# Altium schematic sheet Misc.SchDoc
size A4; SheetNumber: 5; SheetTotal: 6
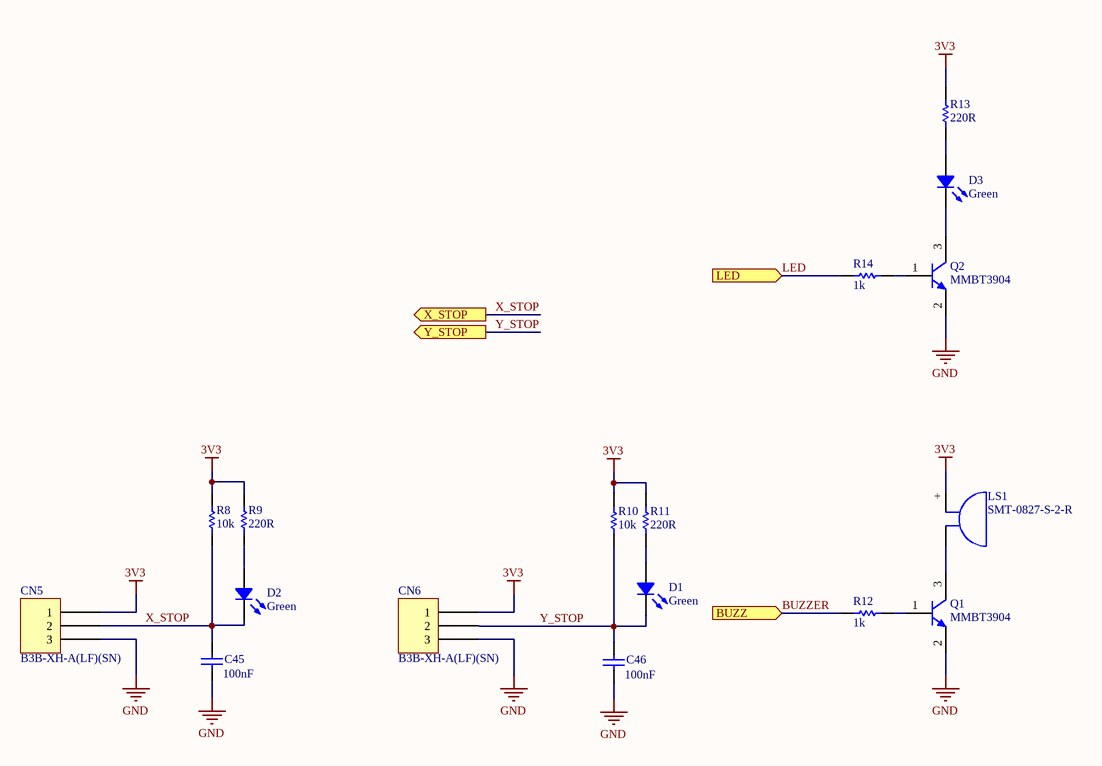
[diagram p0: Misc.SchDoc]

## Parts
C45  value 100nF  [1608[0603]]  (hidden comment: X5R)
C46  value 100nF  [1608[0603]]  (hidden comment: X5R)
CN5  B3B-XH-A(LF)(SN)  [JST XH B3B-XH-A]
CN6  B3B-XH-A(LF)(SN)  [JST XH B3B-XH-A]
D1  Green  [LED 0805_2012 GREEN]
D2  Green  [LED 0805_2012 GREEN]
D3  Green  [LED 0805_2012 GREEN]
LS1  SMT-0827-S-2-R  [PUI Audio SMT-0827-S-2-R]
Q1  MMBT3904  [SOT-23_N]
Q2  MMBT3904  [SOT-23_N]
R8  value 10k  [1608[0603]]  (hidden comment: Res1)
R9  value 220R  [1608[0603]]  (hidden comment: Res1)
R10  value 10k  [1608[0603]]  (hidden comment: Res1)
R11  value 220R  [1608[0603]]  (hidden comment: Res1)
R12  value 1k  [1608[0603]]  (hidden comment: Res1)
R13  value 220R  [1608[0603]]  (hidden comment: Res1)
R14  value 1k  [1608[0603]]  (hidden comment: Res1)

## Ports
BUZZ (in, see Motherboard[1B], STM32F7[2A]), LED (in, see Motherboard[1B], STM32F7[2A]), X_STOP (out, see Motherboard[1B], STM32F7[2A]), Y_STOP (out, see Motherboard[1B], STM32F7[2A])

## Nets
3V3: CN5.1 CN6.1 LS1.+ R8.1 R9.1 R10.1 R11.1 R13.1
GND: C45.2 C46.2 CN5.3 CN6.3 Q1.2(E) Q2.2(E)
BUZZER: R12.1 ; port BUZZ
LED: R14.1 ; port LED
X_STOP: C45.1 CN5.2 D2.2 R8.2 ; port X_STOP
Y_STOP: C46.1 CN6.2 D1.2 R10.2 ; port Y_STOP
NetD1_1: D1.1 R11.2
NetD2_1: D2.1 R9.2
NetD3_1: D3.1 R13.2
NetD3_2: D3.2 Q2.3(C)
NetLS1_-: LS1.- Q1.3(C)
NetQ1_1: Q1.1(B) R12.2
NetQ2_1: Q2.1(B) R14.2

## Library data of the parts
C45 C46 = Cap: Capacitor; Published: 8-Jun-2000; LatestRevisionDate: 17-Jul-2002; LatestRevisionNote: Re-released for DXP Platform.; PackageReference: RAD-0.3; Publisher: Altium Limited; PackageDescription: Radial Cap, Thru-Hole; 2 Leads; 0.3 in Pin Spacing
CN5 CN6 = B3B-XH-A(LF)(SN): CONN HEADER VERT 3POS 2.5MM; Manufacturer: JST Sales America Inc.; Contact Length - Post: 0.134" (3.40mm); Current Rating (Amps): 3A; Material Flammability Rating: UL94 V-0; Number of Positions: 3; Number of Positions Loaded: All; Pitch - Mating: 0.098" (2.50mm); Shrouding: Shrouded - 4 Wall; Style: Board to Cable/Wire; Voltage Rating: 250V; Part Number: B3B-XH-A(LF)(SN); ComponentLink1Description: Datasheet; ComponentLink1URL: http://www.jst-mfg.com/product/pdf/eng/eXH.pdf; ComponentLink2Description: DigiKey Link; ComponentLink2URL: http://digikey.com/product-detail/en/jst-sales-america-inc/B3B-XH-A-LF-SN/455-2248-ND/1651046; Connector Type: Header; Contact Finish - Mating: Tin; Contact Finish - Post: Tin; Contact Material: Brass; Contact Shape: Square; Contact Type: Male Pin; Fastening Type: Detent Lock; Insulation Color: Natural; Insulation Height: 0.276" (7.00mm); Insulation Material: Polyamide (PA66), Nylon 6/6; LastUpdated: 1/12/2020 11:46:22 PM; Lifecycle Status: Active; Minimum Order: 1; Mounting Type: Through Hole; Number of Rows: 1; Operating Temperature: -25°C ~ 85°C; Packaging: Bulk; PartId: 68; Part Status: Active; Price: 0.19; Series: XH; Supplier 1: DigiKey; Supplier Part Number 1: 455-2248-ND; Termination: Press-Fit, Solder
D1-D3 = QTLP630C4TR: LED GREEN CLEAR 0805 SMD; Manufacturer: Everlight Electronics Co Ltd; Configuration: Standard; Current - Test: 20mA; Lens Color: Colorless; Lens Size: 1.40mm x 1.25mm; Lens Style: Rectangle with Flat Top; Millicandela Rating: 10mcd; Viewing Angle: 140°; Voltage - Forward (Vf) (Typ): 2.1V; Wavelength - Dominant: 570nm; Wavelength - Peak: 565nm; Part Number: QTLP630C4TR; Color: Green; ComponentLink1Description: Datasheet; ComponentLink1URL: //media.digikey.com/PDF/Data%20Sheets/Everlight%20PDFs/QTLP630-2.pdf; ComponentLink2Description: DigiKey Link; ComponentLink2URL: https://www.digikey.com/en/products/detail/everlight-electronics-co-ltd/QTLP630C4TR/2675902; Device Package: 0805 (2012 Metric); Height (Max): 1.20mm; LastUpdated: 3/28/2023 7:59:32 PM; Lens Transparency: Clear; Lifecycle Status: Active; Minimum Order: 1; Mounting Type: Surface Mount; Package / Case: 0805 (2012 Metric); Packaging: TapeAndReel; PartId: 240; Part Status: Active; Price: 0.04; Series: -; Size / Dimension: 2.00mm L x 1.25mm W; Supplier 1: DigiKey; Supplier Part Number 1: 1080-1411-1-ND; Supplier Device Package: 0805; Value: Green
LS1 = SMT-0827-S-2-R: AUDIO MAGNETIC XDCR 2.5-4.5V SMD; Manufacturer: PUI Audio, Inc.; Current - Supply: 90mA; Driver Circuitry: Transducer, Externally Driven; Frequency: 2.7kHz; Input Type: Zero-Peak Signal; Operating Mode: Single Tone; Port Location: Side; Sound Pressure Level (SPL): 92dB @ 3.6V, 10cm; Voltage Range: 2.5 ~ 4.5V; Voltage - Rated: 3.6V; Part Number: SMT-0827-S-2-R; ComponentLink1Description: Datasheet; ComponentLink1URL: http://www.puiaudio.com/pdf/SMT-0827-S-2-R.pdf; ComponentLink2Description: DigiKey Link; ComponentLink2URL: http://digikey.com/product-detail/en/pui-audio-inc/SMT-0827-S-2-R/668-1072-1-ND/1464939; Height - Seated (Max): 0.177" (4.50mm); LastUpdated: 4/24/2020 12:38:09 AM; Lifecycle Status: Active; Minimum Order: 1; Mounting Type: Surface Mount; Operating Temperature: -30°C ~ 70°C; Packaging: TapeAndReel; Part Status: Active; Price: 2.03; Series: SMT; Size / Dimension: 0.335" L x 0.335" W (8.50mm x 8.50mm); Supplier 1: DigiKey; Supplier Part Number 1: 668-1072-1-ND; Technology: Magnetic; Termination: Solder Pads
Q1 Q2 = MMBT3904TT1G: TRANS NPN 40V 0.2A SOT416; Manufacturer: ON Semiconductor; Current - Collector (Ic) (Max): 200mA; DC Current Gain (hFE) (Min) @ Ic, Vce: 100 @ 10mA, 1V; Frequency - Transition: 300MHz; Power - Max: 300mW; Vce Saturation (Max) @ Ib, Ic: 300mV @ 5mA, 50mA; Part Number: MMBT3904TT1G; ComponentLink1Description: Datasheet; ComponentLink1URL: https://www.onsemi.com/pub/Collateral/MMBT3904TT1-D.PDF; ComponentLink2Description: DigiKey Link; ComponentLink2URL: http://digikey.com/product-detail/en/on-semiconductor/MMBT3904TT1G/MMBT3904TT1GOSCT-ND/1139815; LastUpdated: 2/1/2023 9:06:25 PM; Lifecycle Status: Active; Minimum Order: 1; Mounting Type: Surface Mount; Operating Temperature: -55°C ~ 150°C (TJ); Package / Case: SC-75, SOT-416; Packaging: TapeAndReel; PartId: 34; Part Status: Active; Price: 0.02; Series: -; Supplier 1: DigiKey; Supplier Part Number 1: MMBT3904TT1GOSCT-ND; Supplier Device Package: SC-75, SOT-416; Transistor Type: NPN; Voltage - Collector Emitter Breakdown (Max): 40V
R8-R14 = Res1: Resistor; Published: 8-Jun-2000; LatestRevisionDate: 17-Jul-2002; LatestRevisionNote: Re-released for DXP Platform.; PackageReference: AXIAL-0.3; Publisher: Altium Limited; PackageDescription: Axial Device, Thru-Hole; 2 Leads; 0.3 in Pin Spacing